# EAGLE schematic UART (EAGLE 6.5.0)
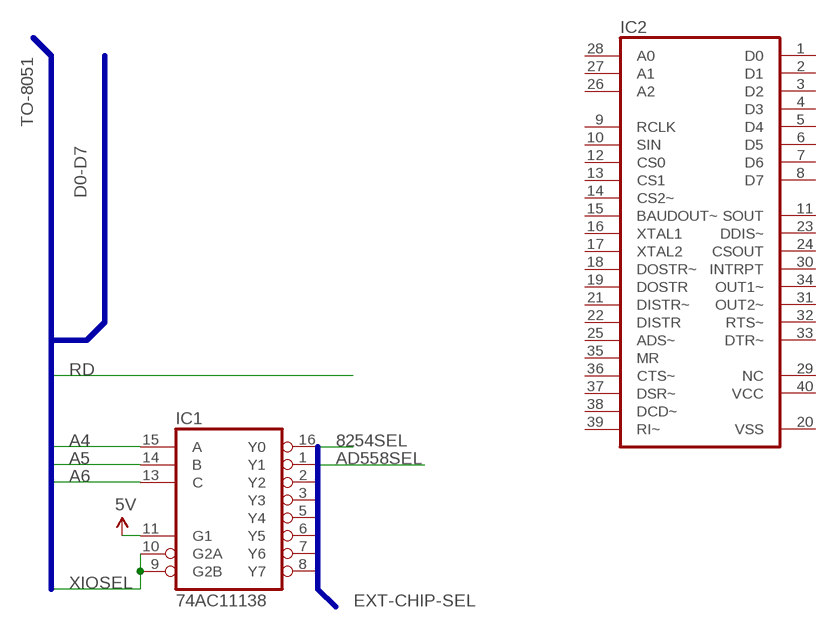
[diagram p0: schematic, sheet 1]

## Parts
IC1  74AC11138  [DIL16]
IC2  XR-16C450P  [DIL40]

## Nets
5V: IC1.11(G1)
8254SEL: IC1.16(Y0)
A4: IC1.15(A)
A5: IC1.14(B)
A6: IC1.13(C)
AD558SEL: IC1.1(Y1)
XIOSEL: IC1.9(G2B) IC1.10(G2A)
Unconnected: IC1.2(Y2) IC1.3(Y3) IC1.5(Y4) IC1.6(Y5) IC1.7(Y6) IC1.8(Y7) IC2.1(D0) IC2.2(D1) IC2.3(D2) IC2.4(D3) IC2.5(D4) IC2.6(D5) IC2.7(D6) IC2.8(D7) IC2.9(RCLK) IC2.10(SIN) IC2.11(SOUT) IC2.12(CS0) IC2.13(CS1) IC2.14(CS2~) IC2.15(BAUDOUT~) IC2.16(XTAL1) IC2.17(XTAL2) IC2.18(DOSTR~) IC2.19(DOSTR) IC2.21(DISTR~) IC2.22(DISTR) IC2.23(DDIS~) IC2.24(CSOUT) IC2.25(ADS~) IC2.26(A2) IC2.27(A1) IC2.28(A0) IC2.29(NC) IC2.30(INTRPT) IC2.31(OUT2~) IC2.32(RTS~) IC2.33(DTR~) IC2.34(OUT1~) IC2.35(MR) IC2.36(CTS~) IC2.37(DSR~) IC2.38(DCD~) IC2.39(RI~)

## Buses
D0-D7
EXT-CHIP-SEL
TO-8051

## Power pins joined to a net without a drawn wire
GND: IC1.4(GND)
VCC: IC1.12(VCC) IC2.40(VCC)
VSS: IC2.20(VSS)

## Library data of the parts
IC1 = 74ac-logic:74AC11138: 3 to 8 line DECODER/DEMULTIPLEXER
IC2 = exar:XR-16C450P: UART; MPN: ST16C450CP40; OC_FARNELL: 1209618; OC_NEWARK: 24R1445